# Altium project centralised_bms.PrjPcb
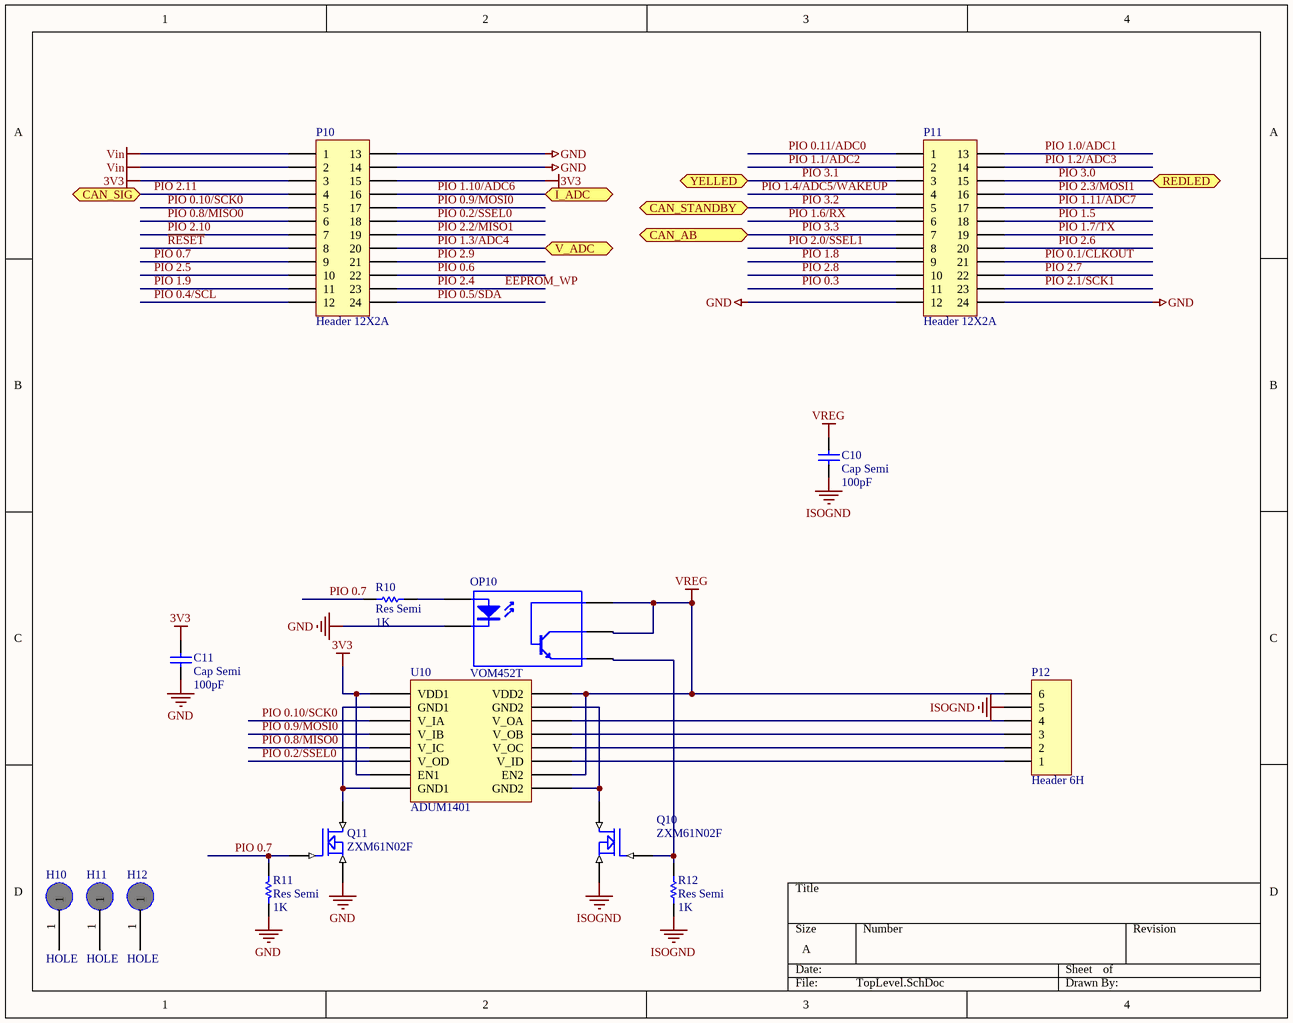
[diagram p0: TopLevel.SchDoc]
1 sheet, 15 parts. Net scope: flat (ports and power ports of the same name join across sheets).
Board file: centralised_bms.PcbDoc

## Sheet TopLevel.SchDoc
size A

### Parts
C10  Cap Semi  value 100pF  [1608[0603]]
C11  Cap Semi  value 100pF  [1608[0603]]
H10  HOLE  [M2.5]
H11  HOLE  [M2.5]
H12  HOLE  [M2.5]
OP10  VOM452T  [VOM452T]
P10  Header 12X2A  [HDR2X12_CEN]
P11  Header 12X2A  [HDR2X12_CEN]
P12  Header 6H  [HDR1X6H]
Q10  ZXM61N02F  [SOT23-3]
Q11  ZXM61N02F  [SOT23-3]
R10  Res Semi  value 1K  [0603]
R11  Res Semi  value 1K  [0603]
R12  Res Semi  value 1K  [0603]
U10  ADUM1401  [SOIC_16_wide]

### Ports
CAN_AB, CAN_SIG, CAN_STANDBY, I_ADC, REDLED (bidir), V_ADC, YELLED (bidir)

### Nets
3V3: C11.2 P10.3 P10.15 U10.1(VDD1) U10.7(EN1)
GND: C11.1 OP10.3(K) P10.13 P10.14 P11.12 P11.24 Q11.2(S) R11.1
ISOGND: C10.1 P12.5 Q10.2(S) R12.1
Vin: P10.1 P10.2
VREG: C10.2 OP10.5(C) OP10.6(C) P12.6 U10.10(EN2) U10.16(VDD2)
EEPROM_WP: P10.23  [also labelled PIO 2.4]
PIO 0.1/CLKOUT: P11.21
PIO 0.2/SSEL0: P10.18 U10.6(V_OD)
PIO 0.3: P11.11
PIO 0.4/SCL: P10.12
PIO 0.5/SDA: P10.24
PIO 0.6: P10.22
PIO 0.7: P10.9 Q11.1(G) R10.2 R11.2
PIO 0.8/MISO0: P10.6 U10.5(V_IC)
PIO 0.9/MOSI0: P10.17 U10.4(V_IB)
PIO 0.10/SCK0: P10.5 U10.3(V_IA)
PIO 0.11/ADC0: P11.1
PIO 1.0/ADC1: P11.13
PIO 1.1/ADC2: P11.2
PIO 1.2/ADC3: P11.14
PIO 1.3/ADC4: P10.20 ; port V_ADC
PIO 1.4/ADC5/WAKEUP: P11.4
PIO 1.5: P11.18
PIO 1.6/RX: P11.6
PIO 1.7/TX: P11.19
PIO 1.8: P11.9
PIO 1.9: P10.11
PIO 1.10/ADC6: P10.16 ; port I_ADC
PIO 1.11/ADC7: P11.17
PIO 2.0/SSEL1: P11.8
PIO 2.1/SCK1: P11.23
PIO 2.2/MISO1: P10.19
PIO 2.3/MOSI1: P11.16
PIO 2.5: P10.10
PIO 2.6: P11.20
PIO 2.7: P11.22
PIO 2.8: P11.10
PIO 2.9: P10.21
PIO 2.10: P10.7
PIO 2.11: P10.4 ; port CAN_SIG
PIO 3.0: P11.15 ; port REDLED
PIO 3.1: P11.3 ; port YELLED
PIO 3.2: P11.5 ; port CAN_STANDBY
PIO 3.3: P11.7 ; port CAN_AB
~{RESET}: P10.8
NetOP10_1: OP10.1(A) R10.1
NetOP10_4: OP10.4(E) Q10.1(G) R12.2
NetP12_1: P12.1 U10.11(V_ID)
NetP12_2: P12.2 U10.12(V_OC)
NetP12_3: P12.3 U10.13(V_OB)
NetP12_4: P12.4 U10.14(V_OA)
NetQ10_3: Q10.3(D) U10.9(GND2) U10.15(GND2)
NetQ11_3: Q11.3(D) U10.2(GND1) U10.8(GND1)

Not connected (* = marked no-connect by the designer): H10 1; H11 1; H12 1

### Library data of the parts
C10 C11 = Cap Semi: Capacitor (Semiconductor SIM Model); Published: 8-Jun-2000; LatestRevisionDate: 29-May-2009; LatestRevisionNote: IPC-7351 Footprint Added.; PackageReference: C1206; Publisher: Altium Limited; PackageDescription: Chip Capacitor
H10-H12 = HOLE: Needed?: NO - Footprint
P10 P11 = Header 12X2A: Header, 12-Pin, Dual row; LatestRevisionDate: 17-Jul-2002; LatestRevisionNote: Re-released for DXP Platform.; Publisher: Altium Limited
P12 = Header 6H: Header, 6-Pin, Right Angle; LatestRevisionDate: 17-Jul-2002; LatestRevisionNote: Re-released for DXP Platform.; Publisher: Altium Limited
Q10 Q11 = ZXM61N02F: 1.7A, 20V N-Channel Enhancement mode FET; Order#: 9525270; Price: 0.803; Supplier: Farnell
R10-R12 = Res Semi: Semiconductor Resistor; Published: 8-Jun-2000; LatestRevisionDate: 17-Jul-2002; LatestRevisionNote: Re-released for DXP Platform.; PackageReference: AXIAL-0.5; Publisher: Altium Limited; PackageDescription: Axial Device, Thru-Hole; 2 Leads; 0.5 in Pin Spacing